# Altium schematic sheet Transformer_Stage.SchDoc
size A4; Organization: Waterloop; Address1: 200 University Ave W; Address2: Engineering 5, 1104; Address3: Waterloo, ON; Address4: N2L 3G1; SheetNumber: 4; SheetTotal: 5
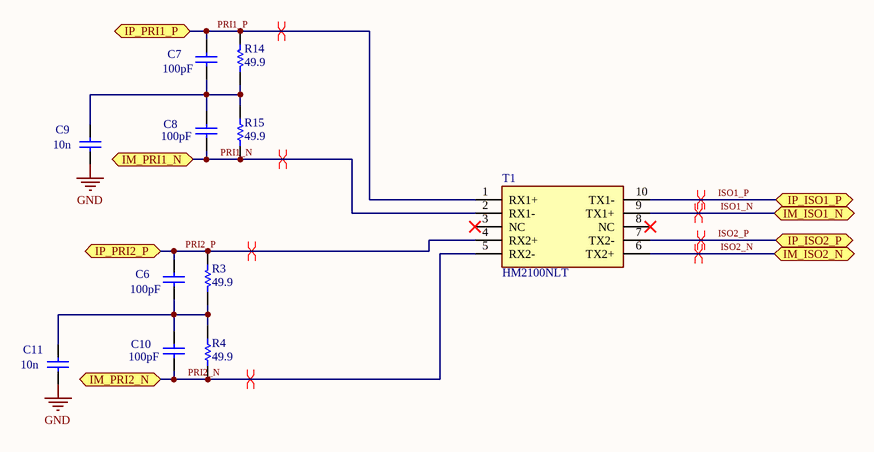
[diagram p0: Transformer_Stage.SchDoc]

## Parts
C6  value 100pF  [0603 - Capacitor]  (hidden comment: Capacitor - Nonpolarized)
C7  value 100pF  [0603 - Capacitor]  (hidden comment: Capacitor - Nonpolarized)
C8  value 100pF  [0603 - Capacitor]  (hidden comment: Capacitor - Nonpolarized)
C9  value 10n  [0603 - Capacitor]  (hidden comment: Capacitor - Nonpolarized)
C10  value 100pF  [0603 - Capacitor]  (hidden comment: Capacitor - Nonpolarized)
C11  value 10n  [0603 - Capacitor]  (hidden comment: Capacitor - Nonpolarized)
R3  value 49.9  [0603 - Resistor]  (hidden comment: Resistor)
R4  value 49.9  [0603 - Resistor]  (hidden comment: Resistor)
R14  value 49.9  [0603 - Resistor]  (hidden comment: Resistor)
R15  value 49.9  [0603 - Resistor]  (hidden comment: Resistor)
T1  HM2100NLT  [HM2100NLT]

## Ports
IM_ISO1_N (bidir, see Monitoring IC[4A]), IM_ISO2_N (bidir, see Monitoring IC[4B]), IM_PRI1_N (bidir, see Monitoring IC[3A]), IM_PRI2_N (bidir, see Monitoring IC[3B]), IP_ISO1_P (bidir, see Monitoring IC[4A]), IP_ISO2_P (bidir, see Monitoring IC[4B]), IP_PRI1_P (bidir, see Monitoring IC[3A]), IP_PRI2_P (bidir, see Monitoring IC[3B])

## Nets
GND: C9.2 C11.2
ISO1_N: T1.9(TX1+) ; port IM_ISO1_N
ISO1_P: T1.10(TX1-) ; port IP_ISO1_P
ISO2_N: T1.6(TX2+) ; port IM_ISO2_N
ISO2_P: T1.7(TX2-) ; port IP_ISO2_P
PRI1_N: C8.2 R15.1 T1.2(RX1-) ; port IM_PRI1_N
PRI1_P: C7.1 R14.1 T1.1(RX1+) ; port IP_PRI1_P
PRI2_N: C10.2 R4.1 T1.5(RX2-) ; port IM_PRI2_N
PRI2_P: C6.1 R3.1 T1.4(RX2+) ; port IP_PRI2_P
NetC6_2: C6.2 C10.1 C11.1 R3.2 R4.2
NetC7_2: C7.2 C8.1 C9.1 R14.2 R15.2

Not connected (* = marked no-connect by the designer): T1 3(NC)* 8(NC)*

## Layout directives
differential pair: ISO1_N, ISO1_P, ISO2_N, ISO2_P, PRI1_N, PRI1_P, PRI2_N, PRI2_P

## Notes on the sheet
- Title:
- Size:
- Date:
- A4
- Author:
- Revision:
- Sheet
- of
- File:

## Library data of the parts
C6-C11 = Capacitor - Nonpolarized: Nonpolarized Capacitor; Supplier Part Number: *; Supplier: *; Manufacturer: *; Rating: *; Manufacturer Part Number: *
T1 = HM2100NLT: Pulse Transformer 1:1 Surface Mount 150µH, 450µH; Manufacturer: Pulse Electronics; Supplier Part Number: 1840-1032-1-ND; Supplier: Digikey; Manufacturer Part Number: HM2100NLT; ComponentLink1Description: Datasheet; ComponentLink1URL: https://productfinder.pulseeng.com/doc_type/WEB301/doc_num/HM2100NL/doc_part/HM2100NL.pdf
R3 R4 R14 R15 = Resistor: Rating: *; Manufacturer Part Number: *; Manufacturer: *; Supplier Part Number: *; Supplier: *